# EAGLE design bmp180 (EAGLE 7.3.0)
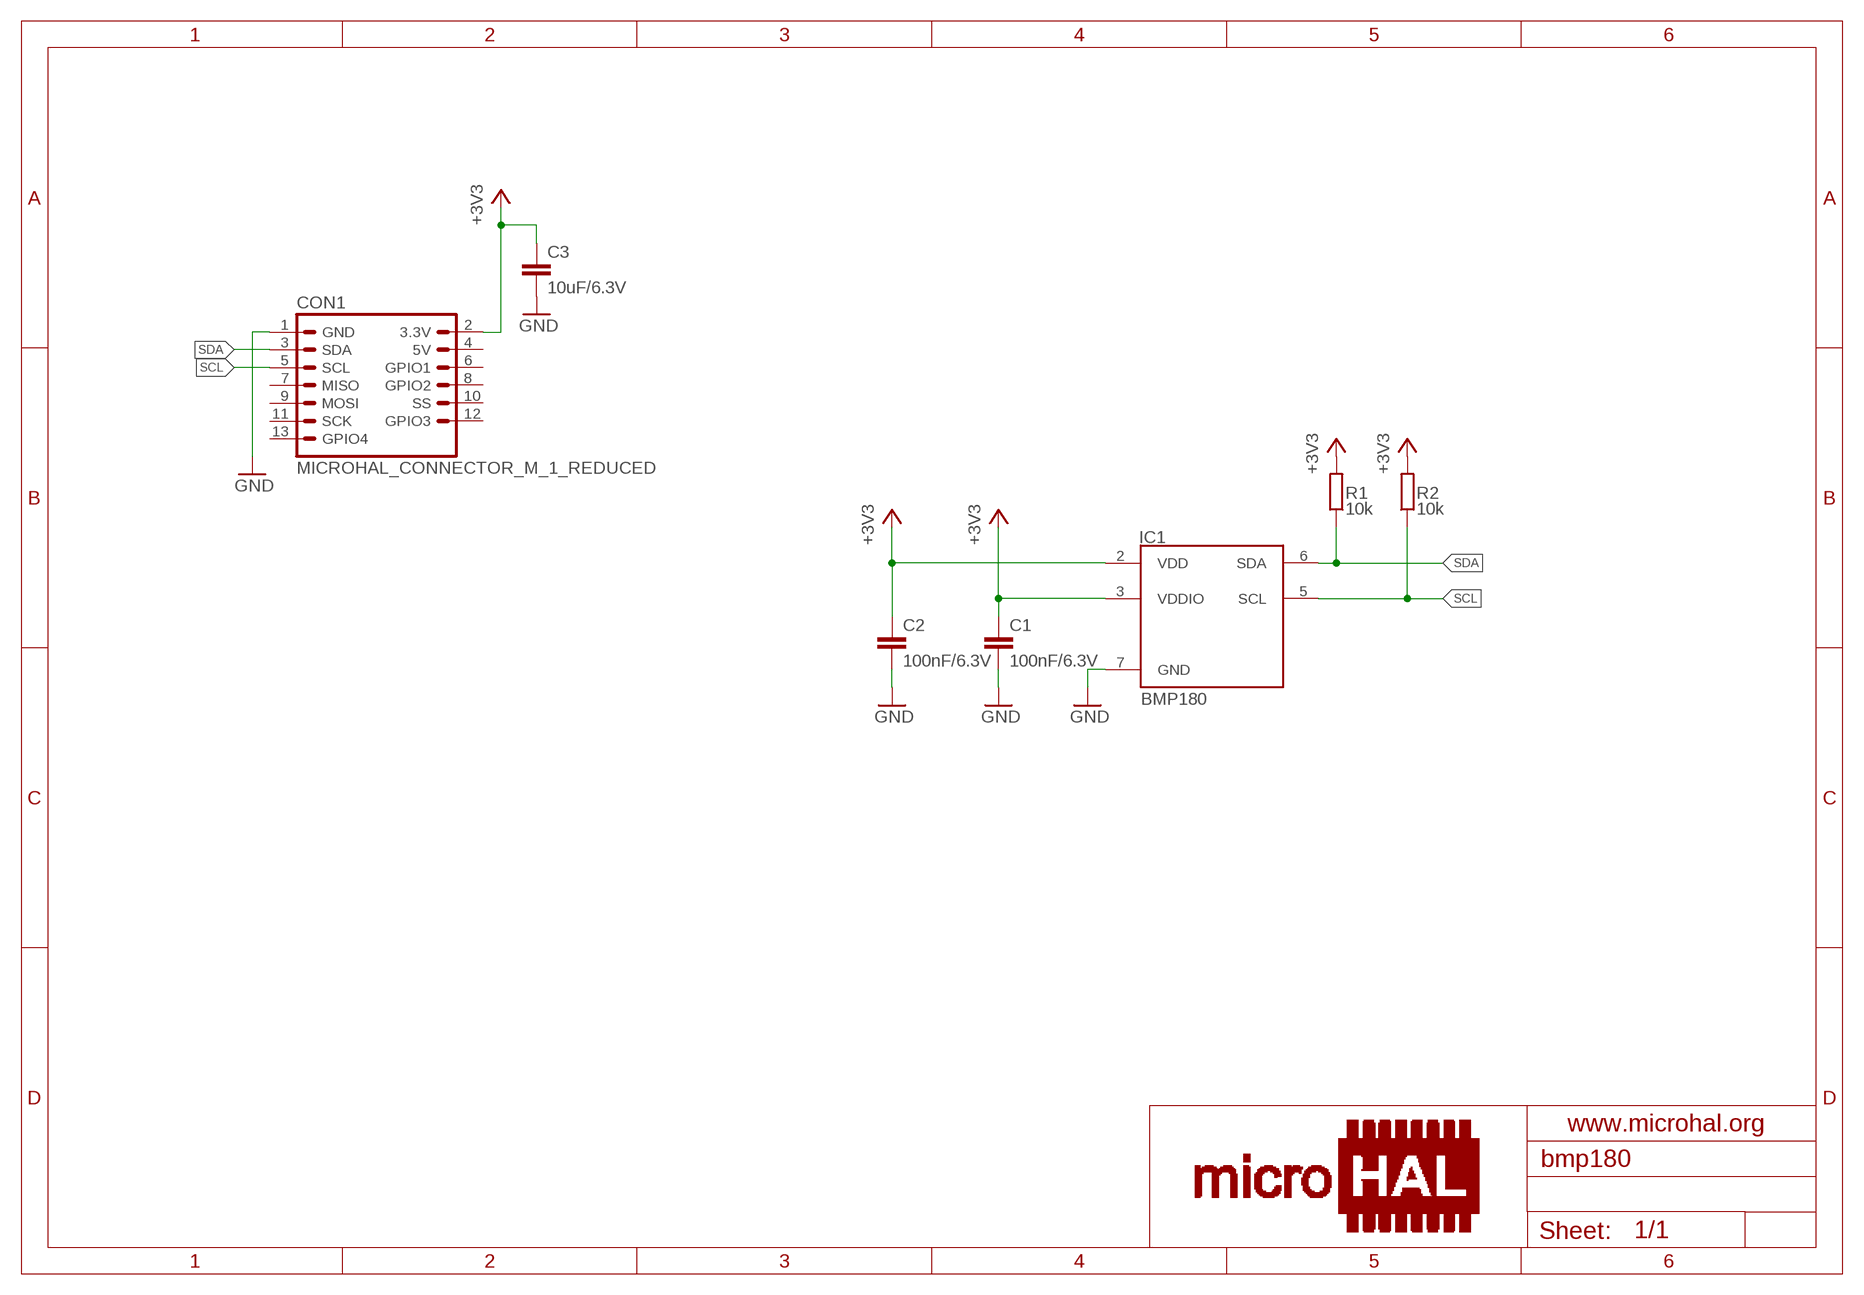
[diagram p0: schematic, sheet 1]

## Parts
C1  100nF/6.3V  C-EUC0603K  [C0603K]
C2  100nF/6.3V  C-EUC0603K  [C0603K]
C3  10uF/6.3V  C-EUC0805K  [C0805K]
CON1  MICROHAL_CONNECTOR_M_1_REDUCED  [MICROHAL_CONNECTOR_M_1_REDUCED_EDGE]
IC1  BMP180  [LGA7]
R1  10k  R-EU_R0603  [R0603]
R2  10k  R-EU_R0603  [R0603]

## Nets
+3V3: C1.1 C2.1 C3.1 CON1.2(3.3V) IC1.2(VDD) IC1.3(VDDIO) R1.2 R2.2
GND: C1.2 C2.2 C3.2 CON1.1(GND) IC1.7(GND)
SCL: CON1.5(SCL) IC1.5(SCL) R2.1
SDA: CON1.3(SDA) IC1.6(SDA) R1.1
Unconnected: CON1.4(5V) CON1.6(GPIO1) CON1.7(MISO) CON1.8(GPIO2) CON1.9(MOSI) CON1.10(SS) CON1.11(SCK) CON1.12(GPIO3) CON1.13(GPIO4)

## Library data of the parts
C1-C3 = rcl:C-EU: CAPACITOR, European symbol
CON1 = microhal-connector_v0.1:MICROHAL_CONNECTOR_M_1_REDUCED
IC1 = bmp180:BMP180
R1 R2 = rcl:R-EU_: RESISTOR, European symbol

## Board
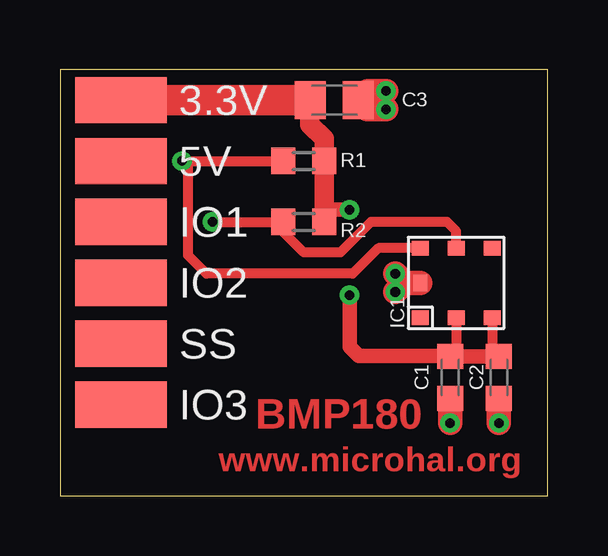
[diagram p1: board, top side]
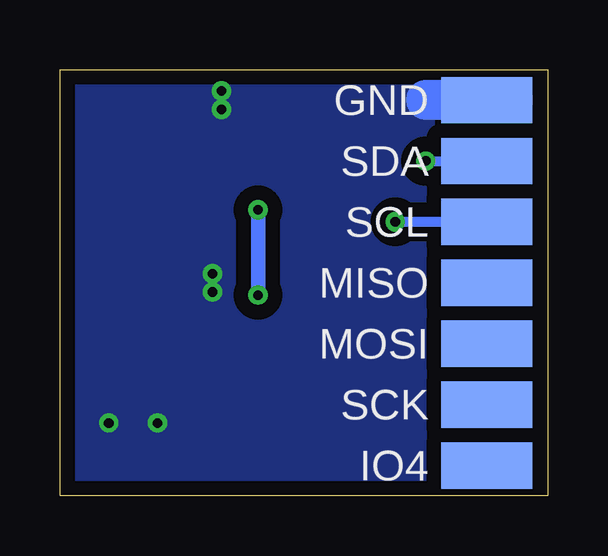
[diagram p2: board, bottom side, seen from below]

Size 20.32 x 17.78 mm. Coordinates in mm from the lower left corner, seen from the top.
Outline: 0,0 20.32,0 20.32,17.78 0,17.78 0,0
Copper layers (1*16): Top 0.035mm / dielectric 1.5mm / Bottom 0.035mm
Design rules "default *": minimum track width 10mil, minimum drill 15mil, track to track 8mil, track to pad 8mil, pad to pad 8mil, via to via 8mil, smd to smd 4mil, copper to edge 20mil, drill to drill 8mil, minimum pad ring 10mil, minimum via ring 8mil, stop-mask expansion 4mil, vias tented up to drill 16mil, thermal gap 10mil

### Footprints (pad centres in the part's own frame; a part is rotated, then mirrored left to right if it is on the bottom)
C0603K = smd 1.05 x 1.08: 1 -0.875,0; 2 0.875,0
C0805K = smd 1.3 x 1.6: 1 -1,0; 2 1,0
MICROHAL_CONNECTOR_M_1_REDUCED_EDGE = smd 1.93 x 3.81 bottom: 1 -7.62,0; 3 -5.08,0; 5 -2.54,0; 7 0,0; 9 2.54,0; 11 5.08,0; 13 7.62,0 | smd 1.93 x 3.81: 2 -7.62,0; 4 -5.08,0; 6 -2.54,0; 8 0,0; 10 2.54,0; 12 5.08,0
LGA7 = smd 0.7 x 0.6: 1 -1.5,-1.45; 2 0,-1.45; 3 1.5,-1.45; 4 1.5,1.45; 5 0,1.45; 6 -1.5,1.45 | smd 0.6 x 0.7: 7 -1.5,0
R0603 = smd 1 x 1.1: 1 -0.85,0; 2 0.85,0

### Placement (x,y rotation side)
C1  16.26,4.95 270 top
C2  18.29,4.95 270 top
C3  11.43,16.51 0 top
CON1  2.54,8.89 270 top
IC1  16.51,8.89 0 top
R1  10.16,13.97 0 top
R2  10.16,11.43 0 top

### Tracks (layer width: path | path; a pad name or v marks a point on that pad's centre or on a via)
+3V3  (via drill 0.4)
  Top 0.406: IC1.2 16.51,6.08 C1.1 | IC1.3 18.01,6.11 C2.1
  Top 0.61: C2.1 C1.1 | 16.24,5.84 12.45,5.84 12.06,6.22 v12.06,8.38 | v12.06,11.94 11.01,11.94
  Top 0.813: R2.2 11.01,11.94 R1.2 11.01,14.9 10.41,15.49 10.41,16.49 C3.1
  Top 1.016: C1.1 16.24,5.84
  Top 1.27: CON1.2 C3.1
  Bottom 0.61: v12.06,8.38 v12.06,11.94
GND  (via drill 0.4)
  Top 1.016: v13.59,16.13 12.81,16.13 C3.2 | v13.59,16.89 12.83,16.89 12.45,16.51 | v16.26,3.05 C1.2 | v18.29,3.05 C2.2 | IC1.7 14.99,8.89 14.35,8.89 | 14.35,8.89 v13.97,8.51 | v13.97,9.27 14.35,8.89
  Bottom 1.676: CON1.1 5.08,16.51
  pour Bottom (isolate 0.61): 0,17.78 20.32,17.78 20.32,0 0,0
SCL  (via drill 0.4)
  Top 0.406: IC1.5 16.51,11.05 16.13,11.43 12.95,11.43 11.68,10.16 10.16,10.16 9.31,11.01 R2.1 | 9.4,11.34 R2.1 | v6.35,11.43 R2.1
  Bottom 0.406: CON1.5 v6.35,11.43
SDA  (via drill 0.4)
  Top 0.406: 5.33,13.97 5.33,10.03 6.1,9.27 12.19,9.27 13.26,10.34 IC1.6 | 5.33,13.97 R1.1 | 5.33,13.97 v5.08,13.97
  Bottom 0.406: v5.08,13.97 CON1.3

### Text on the board
Top: BMP180 | www.microhal.org
tStop: BMP180 | www.microhal.org